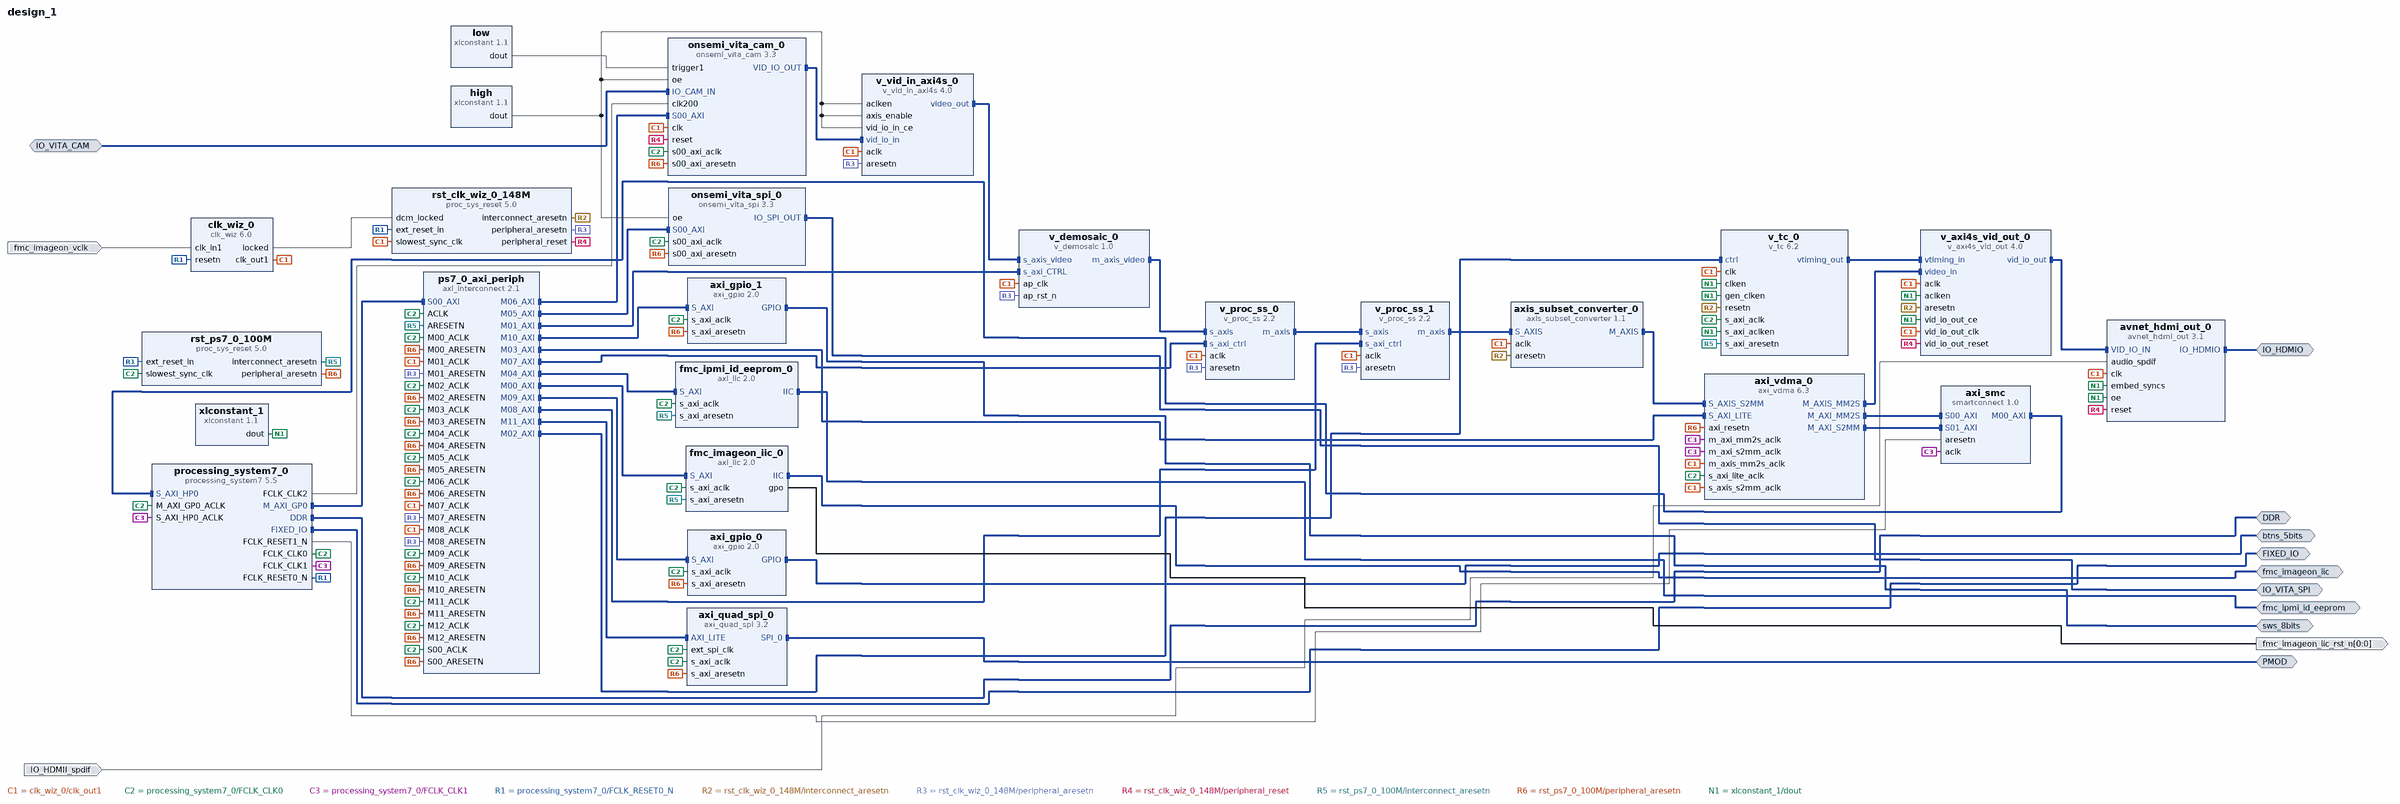
[diagram p0: block diagram of the top level]
# Vivado block design design_1, xc7z020clg484-1, Vivado 2020.1
create_bd_design design_1

create_bd_intf_port -mode Master -vlnv xilinx.com:interface:ddrx_rtl:1.0 DDR
create_bd_intf_port -mode Master -vlnv xilinx.com:display_processing_system7:fixedio_rtl:1.0 FIXED_IO
create_bd_intf_port -mode Master -vlnv avnet.com:interface:avnet_hdmi_rtl:2.0 IO_HDMIO
create_bd_intf_port -mode Master -vlnv xilinx.com:interface:iic_rtl:1.0 fmc_imageon_iic
create_bd_intf_port -mode Master -vlnv xilinx.com:interface:iic_rtl:1.0 fmc_ipmi_id_eeprom
create_bd_intf_port -mode Master -vlnv avnet.com:interface:onsemi_vita_spi_rtl:1.0 IO_VITA_SPI
create_bd_intf_port -mode Slave -vlnv avnet.com:interface:onsemi_vita_cam_rtl:1.0 IO_VITA_CAM
create_bd_intf_port -mode Master -vlnv xilinx.com:interface:gpio_rtl:1.0 btns_5bits
create_bd_intf_port -mode Master -vlnv xilinx.com:interface:gpio_rtl:1.0 sws_8bits
create_bd_intf_port -mode Master -vlnv xilinx.com:interface:spi_rtl:1.0 PMOD
create_bd_port -dir O -from 0 -to 0 fmc_imageon_iic_rst_n
create_bd_port -dir I IO_HDMII_spdif
create_bd_port -dir I -type clk fmc_imageon_vclk
set_property -dict {CONFIG.FREQ_HZ 148500000} [get_bd_ports fmc_imageon_vclk]

create_bd_cell -type ip -vlnv avnet:avnet_hdmi:avnet_hdmi_out:3.1 avnet_hdmi_out_0
create_bd_cell -type ip -vlnv xilinx.com:ip:processing_system7:5.5 processing_system7_0
set_property -dict [list \
  CONFIG.PCW_APU_PERIPHERAL_FREQMHZ 666.666667 \
  CONFIG.PCW_ENET0_ENET0_IO {MIO 16 .. 27} \
  CONFIG.PCW_ENET0_GRP_MDIO_ENABLE 1 \
  CONFIG.PCW_ENET0_GRP_MDIO_IO {MIO 52 .. 53} \
  CONFIG.PCW_ENET0_PERIPHERAL_ENABLE 1 \
  CONFIG.PCW_ENET0_RESET_ENABLE 0 \
  CONFIG.PCW_ENET_RESET_ENABLE 1 \
  CONFIG.PCW_ENET_RESET_SELECT {Share reset pin} \
  CONFIG.PCW_EN_CLK1_PORT 1 \
  CONFIG.PCW_EN_CLK2_PORT 1 \
  CONFIG.PCW_EN_RST1_PORT 1 \
  CONFIG.PCW_FCLK_CLK1_BUF TRUE \
  CONFIG.PCW_FCLK_CLK2_BUF TRUE \
  CONFIG.PCW_FPGA0_PERIPHERAL_FREQMHZ 75 \
  CONFIG.PCW_FPGA1_PERIPHERAL_FREQMHZ 150 \
  CONFIG.PCW_FPGA2_PERIPHERAL_FREQMHZ 200 \
  CONFIG.PCW_FPGA_FCLK1_ENABLE 1 \
  CONFIG.PCW_FPGA_FCLK2_ENABLE 1 \
  CONFIG.PCW_GPIO_MIO_GPIO_ENABLE 1 \
  CONFIG.PCW_GPIO_MIO_GPIO_IO MIO \
  CONFIG.PCW_I2C_RESET_ENABLE 1 \
  CONFIG.PCW_PRESET_BANK1_VOLTAGE {LVCMOS 1.8V} \
  CONFIG.PCW_QSPI_GRP_SINGLE_SS_ENABLE 1 \
  CONFIG.PCW_QSPI_GRP_SINGLE_SS_IO {MIO 1 .. 6} \
  CONFIG.PCW_QSPI_PERIPHERAL_ENABLE 1 \
  CONFIG.PCW_QSPI_QSPI_IO {MIO 1 .. 6} \
  CONFIG.PCW_SD0_GRP_CD_ENABLE 1 \
  CONFIG.PCW_SD0_GRP_CD_IO {MIO 47} \
  CONFIG.PCW_SD0_GRP_WP_ENABLE 1 \
  CONFIG.PCW_SD0_GRP_WP_IO {MIO 46} \
  CONFIG.PCW_SD0_PERIPHERAL_ENABLE 1 \
  CONFIG.PCW_SD0_SD0_IO {MIO 40 .. 45} \
  CONFIG.PCW_SDIO_PERIPHERAL_FREQMHZ 50 \
  CONFIG.PCW_SINGLE_QSPI_DATA_MODE x4 \
  CONFIG.PCW_TTC0_PERIPHERAL_ENABLE 1 \
  CONFIG.PCW_TTC0_TTC0_IO EMIO \
  CONFIG.PCW_UART1_PERIPHERAL_ENABLE 1 \
  CONFIG.PCW_UART1_UART1_IO {MIO 48 .. 49} \
  CONFIG.PCW_UART_PERIPHERAL_FREQMHZ 50 \
  CONFIG.PCW_UIPARAM_DDR_FREQ_MHZ 533.333313 \
  CONFIG.PCW_UIPARAM_DDR_PARTNO {MT41J128M16 HA-15E} \
  CONFIG.PCW_USB0_PERIPHERAL_ENABLE 1 \
  CONFIG.PCW_USB0_RESET_ENABLE 0 \
  CONFIG.PCW_USB0_USB0_IO {MIO 28 .. 39} \
  CONFIG.PCW_USB_RESET_ENABLE 1 \
  CONFIG.PCW_USB_RESET_SELECT {Share reset pin} \
  CONFIG.PCW_USE_S_AXI_HP0 1 \
  CONFIG.preset ZedBoard \
] [get_bd_cells processing_system7_0]
# 222 more settings of processing_system7_0 are not shown: defaults, MIO pin electricals, DDR timing, and values the tool derives
create_bd_cell -type ip -vlnv xilinx.com:ip:proc_sys_reset:5.0 rst_clk_wiz_0_148M
create_bd_cell -type ip -vlnv xilinx.com:ip:proc_sys_reset:5.0 rst_ps7_0_100M
create_bd_cell -type ip -vlnv xilinx.com:ip:v_axi4s_vid_out:4.0 v_axi4s_vid_out_0
set_property -dict [list \
  CONFIG.C_ADDR_WIDTH 12 \
  CONFIG.C_HAS_ASYNC_CLK 1 \
  CONFIG.C_S_AXIS_VIDEO_FORMAT 0 \
  CONFIG.C_VTG_MASTER_SLAVE 1 \
] [get_bd_cells v_axi4s_vid_out_0]
create_bd_cell -type ip -vlnv xilinx.com:ip:smartconnect:1.0 axi_smc
set_property -dict {CONFIG.NUM_SI 2} [get_bd_cells axi_smc]
create_bd_cell -type ip -vlnv xilinx.com:ip:axi_vdma:6.3 axi_vdma_0
set_property -dict [list \
  CONFIG.c_m_axis_mm2s_tdata_width 16 \
  CONFIG.c_mm2s_linebuffer_depth 4096 \
  CONFIG.c_num_fstores 3 \
  CONFIG.c_s2mm_linebuffer_depth 4096 \
] [get_bd_cells axi_vdma_0]
create_bd_cell -type ip -vlnv xilinx.com:ip:axis_subset_converter:1.1 axis_subset_converter_0
set_property -dict [list \
  CONFIG.M_TDATA_NUM_BYTES 2 \
  CONFIG.S_TDATA_NUM_BYTES 3 \
  CONFIG.TDATA_REMAP {tdata[15:0]} \
  CONFIG.TDEST_REMAP {tdest[0:0]} \
  CONFIG.TID_REMAP {tid[0:0]} \
  CONFIG.TKEEP_REMAP {tkeep[1:0]} \
  CONFIG.TLAST_REMAP {tlast[0]} \
  CONFIG.TSTRB_REMAP {tstrb[1:0]} \
  CONFIG.TUSER_REMAP {tuser[0:0]} \
] [get_bd_cells axis_subset_converter_0]
create_bd_cell -type ip -vlnv xilinx.com:ip:clk_wiz:6.0 clk_wiz_0
set_property -dict [list \
  CONFIG.CLKIN1_JITTER_PS 67.34 \
  CONFIG.CLKOUT1_JITTER 107.784 \
  CONFIG.CLKOUT1_PHASE_ERROR 92.455 \
  CONFIG.CLKOUT1_REQUESTED_OUT_FREQ 148.500 \
  CONFIG.MMCM_CLKFBOUT_MULT_F 6.750 \
  CONFIG.MMCM_CLKIN1_PERIOD 6.734 \
  CONFIG.MMCM_CLKOUT0_DIVIDE_F 6.750 \
  CONFIG.MMCM_DIVCLK_DIVIDE 1 \
  CONFIG.RESET_PORT resetn \
  CONFIG.RESET_TYPE ACTIVE_LOW \
] [get_bd_cells clk_wiz_0]
create_bd_cell -type ip -vlnv xilinx.com:ip:axi_iic:2.0 fmc_imageon_iic_0
set_property -dict {CONFIG.C_GPO_WIDTH 1} [get_bd_cells fmc_imageon_iic_0]
create_bd_cell -type ip -vlnv xilinx.com:ip:axi_iic:2.0 fmc_ipmi_id_eeprom_0
set_property -dict {CONFIG.C_GPO_WIDTH 8} [get_bd_cells fmc_ipmi_id_eeprom_0]
create_bd_cell -type ip -vlnv xilinx.com:ip:axi_interconnect:2.1 ps7_0_axi_periph
set_property -dict {CONFIG.NUM_MI 13} [get_bd_cells ps7_0_axi_periph]
create_bd_cell -type ip -vlnv xilinx.com:ip:v_tc:6.2 v_tc_0
set_property -dict {CONFIG.VIDEO_MODE 1080p CONFIG.enable_detection false} [get_bd_cells v_tc_0]
create_bd_cell -type ip -vlnv xilinx.com:ip:xlconstant:1.1 xlconstant_1
create_bd_cell -type ip -vlnv avnet:onsemi_vita:onsemi_vita_spi:3.3 onsemi_vita_spi_0
create_bd_cell -type ip -vlnv xilinx.com:ip:xlconstant:1.1 high
create_bd_cell -type ip -vlnv avnet:onsemi_vita:onsemi_vita_cam:3.3 onsemi_vita_cam_0
create_bd_cell -type ip -vlnv xilinx.com:ip:xlconstant:1.1 low
set_property -dict {CONFIG.CONST_VAL 0} [get_bd_cells low]
create_bd_cell -type ip -vlnv xilinx.com:ip:v_vid_in_axi4s:4.0 v_vid_in_axi4s_0
set_property -dict {CONFIG.C_ADDR_WIDTH 12 CONFIG.C_M_AXIS_VIDEO_FORMAT 12} [get_bd_cells v_vid_in_axi4s_0]
create_bd_cell -type ip -vlnv xilinx.com:ip:v_demosaic:1.0 v_demosaic_0
set_property -dict {CONFIG.ALGORITHM 1 CONFIG.ENABLE_ZIPPER_REMOVAL false} [get_bd_cells v_demosaic_0]
create_bd_cell -type ip -vlnv xilinx.com:ip:v_proc_ss:2.2 v_proc_ss_0
set_property -dict [list \
  CONFIG.C_COLORSPACE_SUPPORT 2 \
  CONFIG.C_CSC_ENABLE_WINDOW false \
  CONFIG.C_MAX_DATA_WIDTH 8 \
  CONFIG.C_SAMPLES_PER_CLK 1 \
  CONFIG.C_TOPOLOGY 3 \
] [get_bd_cells v_proc_ss_0]
create_bd_cell -type ip -vlnv xilinx.com:ip:v_proc_ss:2.2 v_proc_ss_1
set_property -dict [list \
  CONFIG.C_H_CHROMA_ALGORITHM 0 \
  CONFIG.C_MAX_DATA_WIDTH 8 \
  CONFIG.C_SAMPLES_PER_CLK 1 \
  CONFIG.C_TOPOLOGY 5 \
] [get_bd_cells v_proc_ss_1]
create_bd_cell -type ip -vlnv xilinx.com:ip:axi_gpio:2.0 axi_gpio_0
set_property -dict {CONFIG.GPIO_BOARD_INTERFACE btns_5bits CONFIG.USE_BOARD_FLOW true} [get_bd_cells axi_gpio_0]
create_bd_cell -type ip -vlnv xilinx.com:ip:axi_gpio:2.0 axi_gpio_1
set_property -dict {CONFIG.GPIO_BOARD_INTERFACE sws_8bits CONFIG.USE_BOARD_FLOW true} [get_bd_cells axi_gpio_1]
create_bd_cell -type ip -vlnv xilinx.com:ip:axi_quad_spi:3.2 axi_quad_spi_0
set_property -dict {CONFIG.C_USE_STARTUP 0} [get_bd_cells axi_quad_spi_0]

# ---- connections ----

connect_bd_intf_net [get_bd_intf_pins v_axi4s_vid_out_0/vtiming_in] [get_bd_intf_pins v_tc_0/vtiming_out]
connect_bd_intf_net [get_bd_intf_ports IO_VITA_SPI] [get_bd_intf_pins onsemi_vita_spi_0/IO_SPI_OUT]
connect_bd_intf_net [get_bd_intf_pins axi_vdma_0/S_AXI_LITE] [get_bd_intf_pins ps7_0_axi_periph/M03_AXI]
connect_bd_intf_net [get_bd_intf_ports DDR] [get_bd_intf_pins processing_system7_0/DDR]
connect_bd_intf_net [get_bd_intf_pins v_proc_ss_0/m_axis] [get_bd_intf_pins v_proc_ss_1/s_axis]
connect_bd_intf_net [get_bd_intf_ports sws_8bits] [get_bd_intf_pins axi_gpio_1/GPIO]
connect_bd_intf_net [get_bd_intf_pins ps7_0_axi_periph/M09_AXI] [get_bd_intf_pins axi_gpio_0/S_AXI]
connect_bd_intf_net [get_bd_intf_pins axi_smc/M00_AXI] [get_bd_intf_pins processing_system7_0/S_AXI_HP0]
connect_bd_intf_net [get_bd_intf_ports btns_5bits] [get_bd_intf_pins axi_gpio_0/GPIO]
connect_bd_intf_net [get_bd_intf_pins ps7_0_axi_periph/M01_AXI] [get_bd_intf_pins v_demosaic_0/s_axi_CTRL]
connect_bd_intf_net [get_bd_intf_pins ps7_0_axi_periph/M08_AXI] [get_bd_intf_pins v_proc_ss_1/s_axi_ctrl]
connect_bd_intf_net [get_bd_intf_pins v_demosaic_0/m_axis_video] [get_bd_intf_pins v_proc_ss_0/s_axis]
connect_bd_intf_net [get_bd_intf_pins ps7_0_axi_periph/M07_AXI] [get_bd_intf_pins v_proc_ss_0/s_axi_ctrl]
connect_bd_intf_net [get_bd_intf_pins axi_vdma_0/S_AXIS_S2MM] [get_bd_intf_pins axis_subset_converter_0/M_AXIS]
connect_bd_intf_net [get_bd_intf_pins ps7_0_axi_periph/M02_AXI] [get_bd_intf_pins v_tc_0/ctrl]
connect_bd_intf_net [get_bd_intf_pins v_vid_in_axi4s_0/video_out] [get_bd_intf_pins v_demosaic_0/s_axis_video]
connect_bd_intf_net [get_bd_intf_pins fmc_imageon_iic_0/S_AXI] [get_bd_intf_pins ps7_0_axi_periph/M00_AXI]
connect_bd_intf_net [get_bd_intf_pins avnet_hdmi_out_0/VID_IO_IN] [get_bd_intf_pins v_axi4s_vid_out_0/vid_io_out]
connect_bd_intf_net -intf_net IIC_FMC_IIC [get_bd_intf_ports fmc_imageon_iic] [get_bd_intf_pins fmc_imageon_iic_0/IIC]
connect_bd_intf_net [get_bd_intf_pins v_vid_in_axi4s_0/vid_io_in] [get_bd_intf_pins onsemi_vita_cam_0/VID_IO_OUT]
connect_bd_intf_net -intf_net fmc_ipmi_id_eeprom_IIC [get_bd_intf_ports fmc_ipmi_id_eeprom] [get_bd_intf_pins fmc_ipmi_id_eeprom_0/IIC]
connect_bd_intf_net [get_bd_intf_pins fmc_ipmi_id_eeprom_0/S_AXI] [get_bd_intf_pins ps7_0_axi_periph/M04_AXI]
connect_bd_intf_net [get_bd_intf_ports FIXED_IO] [get_bd_intf_pins processing_system7_0/FIXED_IO]
connect_bd_intf_net [get_bd_intf_pins v_proc_ss_1/m_axis] [get_bd_intf_pins axis_subset_converter_0/S_AXIS]
connect_bd_intf_net [get_bd_intf_pins ps7_0_axi_periph/M06_AXI] [get_bd_intf_pins onsemi_vita_cam_0/S00_AXI]
connect_bd_intf_net -intf_net IO_CAM_IN_0_1 [get_bd_intf_ports IO_VITA_CAM] [get_bd_intf_pins onsemi_vita_cam_0/IO_CAM_IN]
connect_bd_intf_net [get_bd_intf_pins axi_vdma_0/M_AXIS_MM2S] [get_bd_intf_pins v_axi4s_vid_out_0/video_in]
connect_bd_intf_net [get_bd_intf_pins processing_system7_0/M_AXI_GP0] [get_bd_intf_pins ps7_0_axi_periph/S00_AXI]
connect_bd_intf_net [get_bd_intf_pins axi_smc/S00_AXI] [get_bd_intf_pins axi_vdma_0/M_AXI_MM2S]
connect_bd_intf_net [get_bd_intf_pins axi_smc/S01_AXI] [get_bd_intf_pins axi_vdma_0/M_AXI_S2MM]
connect_bd_intf_net [get_bd_intf_ports IO_HDMIO] [get_bd_intf_pins avnet_hdmi_out_0/IO_HDMIO]
connect_bd_intf_net [get_bd_intf_pins ps7_0_axi_periph/M05_AXI] [get_bd_intf_pins onsemi_vita_spi_0/S00_AXI]
connect_bd_intf_net [get_bd_intf_pins ps7_0_axi_periph/M10_AXI] [get_bd_intf_pins axi_gpio_1/S_AXI]
connect_bd_intf_net [get_bd_intf_pins ps7_0_axi_periph/M11_AXI] [get_bd_intf_pins axi_quad_spi_0/AXI_LITE]
connect_bd_intf_net [get_bd_intf_ports PMOD] [get_bd_intf_pins axi_quad_spi_0/SPI_0]
connect_bd_net -net IIC_FMC_gpo [get_bd_pins fmc_imageon_iic_0/gpo] [get_bd_ports fmc_imageon_iic_rst_n]
connect_bd_net -net audio_spdif_0_1 [get_bd_ports IO_HDMII_spdif] [get_bd_pins avnet_hdmi_out_0/audio_spdif]
connect_bd_net [get_bd_pins clk_wiz_0/clk_out1] \
  [get_bd_pins avnet_hdmi_out_0/clk] [get_bd_pins rst_clk_wiz_0_148M/slowest_sync_clk] [get_bd_pins v_axi4s_vid_out_0/aclk] \
  [get_bd_pins v_axi4s_vid_out_0/vid_io_out_clk] [get_bd_pins axi_vdma_0/m_axis_mm2s_aclk] \
  [get_bd_pins axi_vdma_0/s_axis_s2mm_aclk] [get_bd_pins axis_subset_converter_0/aclk] \
  [get_bd_pins ps7_0_axi_periph/M01_ACLK] [get_bd_pins v_tc_0/clk] [get_bd_pins onsemi_vita_cam_0/clk] \
  [get_bd_pins v_vid_in_axi4s_0/aclk] [get_bd_pins v_demosaic_0/ap_clk] [get_bd_pins v_proc_ss_0/aclk] \
  [get_bd_pins ps7_0_axi_periph/M07_ACLK] [get_bd_pins v_proc_ss_1/aclk] [get_bd_pins ps7_0_axi_periph/M08_ACLK]
connect_bd_net [get_bd_pins clk_wiz_0/locked] [get_bd_pins rst_clk_wiz_0_148M/dcm_locked]
connect_bd_net -net fmc_imageon_video_clk1_1 [get_bd_ports fmc_imageon_vclk] [get_bd_pins clk_wiz_0/clk_in1]
connect_bd_net [get_bd_pins processing_system7_0/FCLK_CLK0] \
  [get_bd_pins processing_system7_0/M_AXI_GP0_ACLK] [get_bd_pins rst_ps7_0_100M/slowest_sync_clk] \
  [get_bd_pins axi_vdma_0/s_axi_lite_aclk] [get_bd_pins fmc_imageon_iic_0/s_axi_aclk] \
  [get_bd_pins fmc_ipmi_id_eeprom_0/s_axi_aclk] [get_bd_pins ps7_0_axi_periph/ACLK] [get_bd_pins ps7_0_axi_periph/S00_ACLK] \
  [get_bd_pins ps7_0_axi_periph/M00_ACLK] [get_bd_pins ps7_0_axi_periph/M02_ACLK] [get_bd_pins ps7_0_axi_periph/M03_ACLK] \
  [get_bd_pins ps7_0_axi_periph/M04_ACLK] [get_bd_pins v_tc_0/s_axi_aclk] [get_bd_pins onsemi_vita_spi_0/s00_axi_aclk] \
  [get_bd_pins ps7_0_axi_periph/M05_ACLK] [get_bd_pins onsemi_vita_cam_0/s00_axi_aclk] \
  [get_bd_pins ps7_0_axi_periph/M06_ACLK] [get_bd_pins axi_gpio_0/s_axi_aclk] [get_bd_pins ps7_0_axi_periph/M09_ACLK] \
  [get_bd_pins axi_gpio_1/s_axi_aclk] [get_bd_pins ps7_0_axi_periph/M10_ACLK] [get_bd_pins ps7_0_axi_periph/M11_ACLK] \
  [get_bd_pins ps7_0_axi_periph/M12_ACLK] [get_bd_pins axi_quad_spi_0/s_axi_aclk] [get_bd_pins axi_quad_spi_0/ext_spi_clk]
connect_bd_net [get_bd_pins processing_system7_0/FCLK_CLK1] \
  [get_bd_pins processing_system7_0/S_AXI_HP0_ACLK] [get_bd_pins axi_smc/aclk] [get_bd_pins axi_vdma_0/m_axi_mm2s_aclk] \
  [get_bd_pins axi_vdma_0/m_axi_s2mm_aclk]
connect_bd_net [get_bd_pins processing_system7_0/FCLK_RESET0_N] \
  [get_bd_pins rst_clk_wiz_0_148M/ext_reset_in] [get_bd_pins rst_ps7_0_100M/ext_reset_in] [get_bd_pins clk_wiz_0/resetn]
connect_bd_net [get_bd_pins processing_system7_0/FCLK_RESET1_N] [get_bd_pins axi_smc/aresetn]
connect_bd_net [get_bd_pins rst_clk_wiz_0_148M/interconnect_aresetn] \
  [get_bd_pins v_axi4s_vid_out_0/aresetn] [get_bd_pins axis_subset_converter_0/aresetn] [get_bd_pins v_tc_0/resetn]
connect_bd_net [get_bd_pins rst_clk_wiz_0_148M/peripheral_aresetn] \
  [get_bd_pins ps7_0_axi_periph/M01_ARESETN] [get_bd_pins v_vid_in_axi4s_0/aresetn] [get_bd_pins v_demosaic_0/ap_rst_n] \
  [get_bd_pins v_proc_ss_0/aresetn] [get_bd_pins ps7_0_axi_periph/M07_ARESETN] [get_bd_pins v_proc_ss_1/aresetn] \
  [get_bd_pins ps7_0_axi_periph/M08_ARESETN]
connect_bd_net [get_bd_pins rst_clk_wiz_0_148M/peripheral_reset] \
  [get_bd_pins avnet_hdmi_out_0/reset] [get_bd_pins v_axi4s_vid_out_0/vid_io_out_reset] [get_bd_pins onsemi_vita_cam_0/reset]
connect_bd_net [get_bd_pins rst_ps7_0_100M/interconnect_aresetn] \
  [get_bd_pins fmc_imageon_iic_0/s_axi_aresetn] [get_bd_pins fmc_ipmi_id_eeprom_0/s_axi_aresetn] \
  [get_bd_pins ps7_0_axi_periph/ARESETN] [get_bd_pins v_tc_0/s_axi_aresetn]
connect_bd_net [get_bd_pins rst_ps7_0_100M/peripheral_aresetn] \
  [get_bd_pins axi_vdma_0/axi_resetn] [get_bd_pins ps7_0_axi_periph/S00_ARESETN] [get_bd_pins ps7_0_axi_periph/M00_ARESETN] \
  [get_bd_pins ps7_0_axi_periph/M02_ARESETN] [get_bd_pins ps7_0_axi_periph/M03_ARESETN] \
  [get_bd_pins ps7_0_axi_periph/M04_ARESETN] [get_bd_pins onsemi_vita_spi_0/s00_axi_aresetn] \
  [get_bd_pins ps7_0_axi_periph/M05_ARESETN] [get_bd_pins onsemi_vita_cam_0/s00_axi_aresetn] \
  [get_bd_pins ps7_0_axi_periph/M06_ARESETN] [get_bd_pins axi_gpio_0/s_axi_aresetn] \
  [get_bd_pins ps7_0_axi_periph/M09_ARESETN] [get_bd_pins axi_gpio_1/s_axi_aresetn] \
  [get_bd_pins ps7_0_axi_periph/M10_ARESETN] [get_bd_pins ps7_0_axi_periph/M11_ARESETN] \
  [get_bd_pins ps7_0_axi_periph/M12_ARESETN] [get_bd_pins axi_quad_spi_0/s_axi_aresetn]
connect_bd_net [get_bd_pins xlconstant_1/dout] \
  [get_bd_pins avnet_hdmi_out_0/embed_syncs] [get_bd_pins avnet_hdmi_out_0/oe] [get_bd_pins v_axi4s_vid_out_0/aclken] \
  [get_bd_pins v_axi4s_vid_out_0/vid_io_out_ce] [get_bd_pins v_tc_0/clken] [get_bd_pins v_tc_0/s_axi_aclken] \
  [get_bd_pins v_tc_0/gen_clken]
connect_bd_net [get_bd_pins low/dout] [get_bd_pins onsemi_vita_cam_0/trigger1]
connect_bd_net [get_bd_pins processing_system7_0/FCLK_CLK2] [get_bd_pins onsemi_vita_cam_0/clk200]
connect_bd_net [get_bd_pins high/dout] \
  [get_bd_pins onsemi_vita_spi_0/oe] [get_bd_pins onsemi_vita_cam_0/oe] [get_bd_pins v_vid_in_axi4s_0/vid_io_in_ce] \
  [get_bd_pins v_vid_in_axi4s_0/aclken] [get_bd_pins v_vid_in_axi4s_0/axis_enable]

# ---- address map ----
assign_bd_address -offset 0x00000000 -range 512M -target_address_space [get_bd_addr_spaces axi_vdma_0/Data_MM2S] [get_bd_addr_segs processing_system7_0/S_AXI_HP0/HP0_DDR_LOWOCM]
assign_bd_address -offset 0x00000000 -range 512M -target_address_space [get_bd_addr_spaces axi_vdma_0/Data_S2MM] [get_bd_addr_segs processing_system7_0/S_AXI_HP0/HP0_DDR_LOWOCM]
assign_bd_address -offset 0x41200000 -range 64K -target_address_space [get_bd_addr_spaces processing_system7_0/Data] [get_bd_addr_segs axi_gpio_0/S_AXI/Reg]
assign_bd_address -offset 0x41210000 -range 64K -target_address_space [get_bd_addr_spaces processing_system7_0/Data] [get_bd_addr_segs axi_gpio_1/S_AXI/Reg]
assign_bd_address -offset 0x41600000 -range 64K -target_address_space [get_bd_addr_spaces processing_system7_0/Data] [get_bd_addr_segs fmc_imageon_iic_0/S_AXI/Reg]
assign_bd_address -offset 0x41610000 -range 64K -target_address_space [get_bd_addr_spaces processing_system7_0/Data] [get_bd_addr_segs fmc_ipmi_id_eeprom_0/S_AXI/Reg]
assign_bd_address -offset 0x41E00000 -range 64K -target_address_space [get_bd_addr_spaces processing_system7_0/Data] [get_bd_addr_segs axi_quad_spi_0/AXI_LITE/Reg]
assign_bd_address -offset 0x43000000 -range 64K -target_address_space [get_bd_addr_spaces processing_system7_0/Data] [get_bd_addr_segs axi_vdma_0/S_AXI_LITE/Reg]
assign_bd_address -offset 0x43C00000 -range 64K -target_address_space [get_bd_addr_spaces processing_system7_0/Data] [get_bd_addr_segs v_demosaic_0/s_axi_CTRL/Reg]
assign_bd_address -offset 0x43C10000 -range 64K -target_address_space [get_bd_addr_spaces processing_system7_0/Data] [get_bd_addr_segs v_tc_0/ctrl/Reg]
assign_bd_address -offset 0x43C20000 -range 64K -target_address_space [get_bd_addr_spaces processing_system7_0/Data] [get_bd_addr_segs onsemi_vita_spi_0/S00_AXI/Reg]
assign_bd_address -offset 0x43C30000 -range 64K -target_address_space [get_bd_addr_spaces processing_system7_0/Data] [get_bd_addr_segs onsemi_vita_cam_0/S00_AXI/Reg]
assign_bd_address -offset 0x43C40000 -range 64K -target_address_space [get_bd_addr_spaces processing_system7_0/Data] [get_bd_addr_segs v_proc_ss_0/s_axi_ctrl/Reg]
assign_bd_address -offset 0x43C50000 -range 64K -target_address_space [get_bd_addr_spaces processing_system7_0/Data] [get_bd_addr_segs v_proc_ss_1/s_axi_ctrl/Reg]

validate_bd_design
save_bd_design
